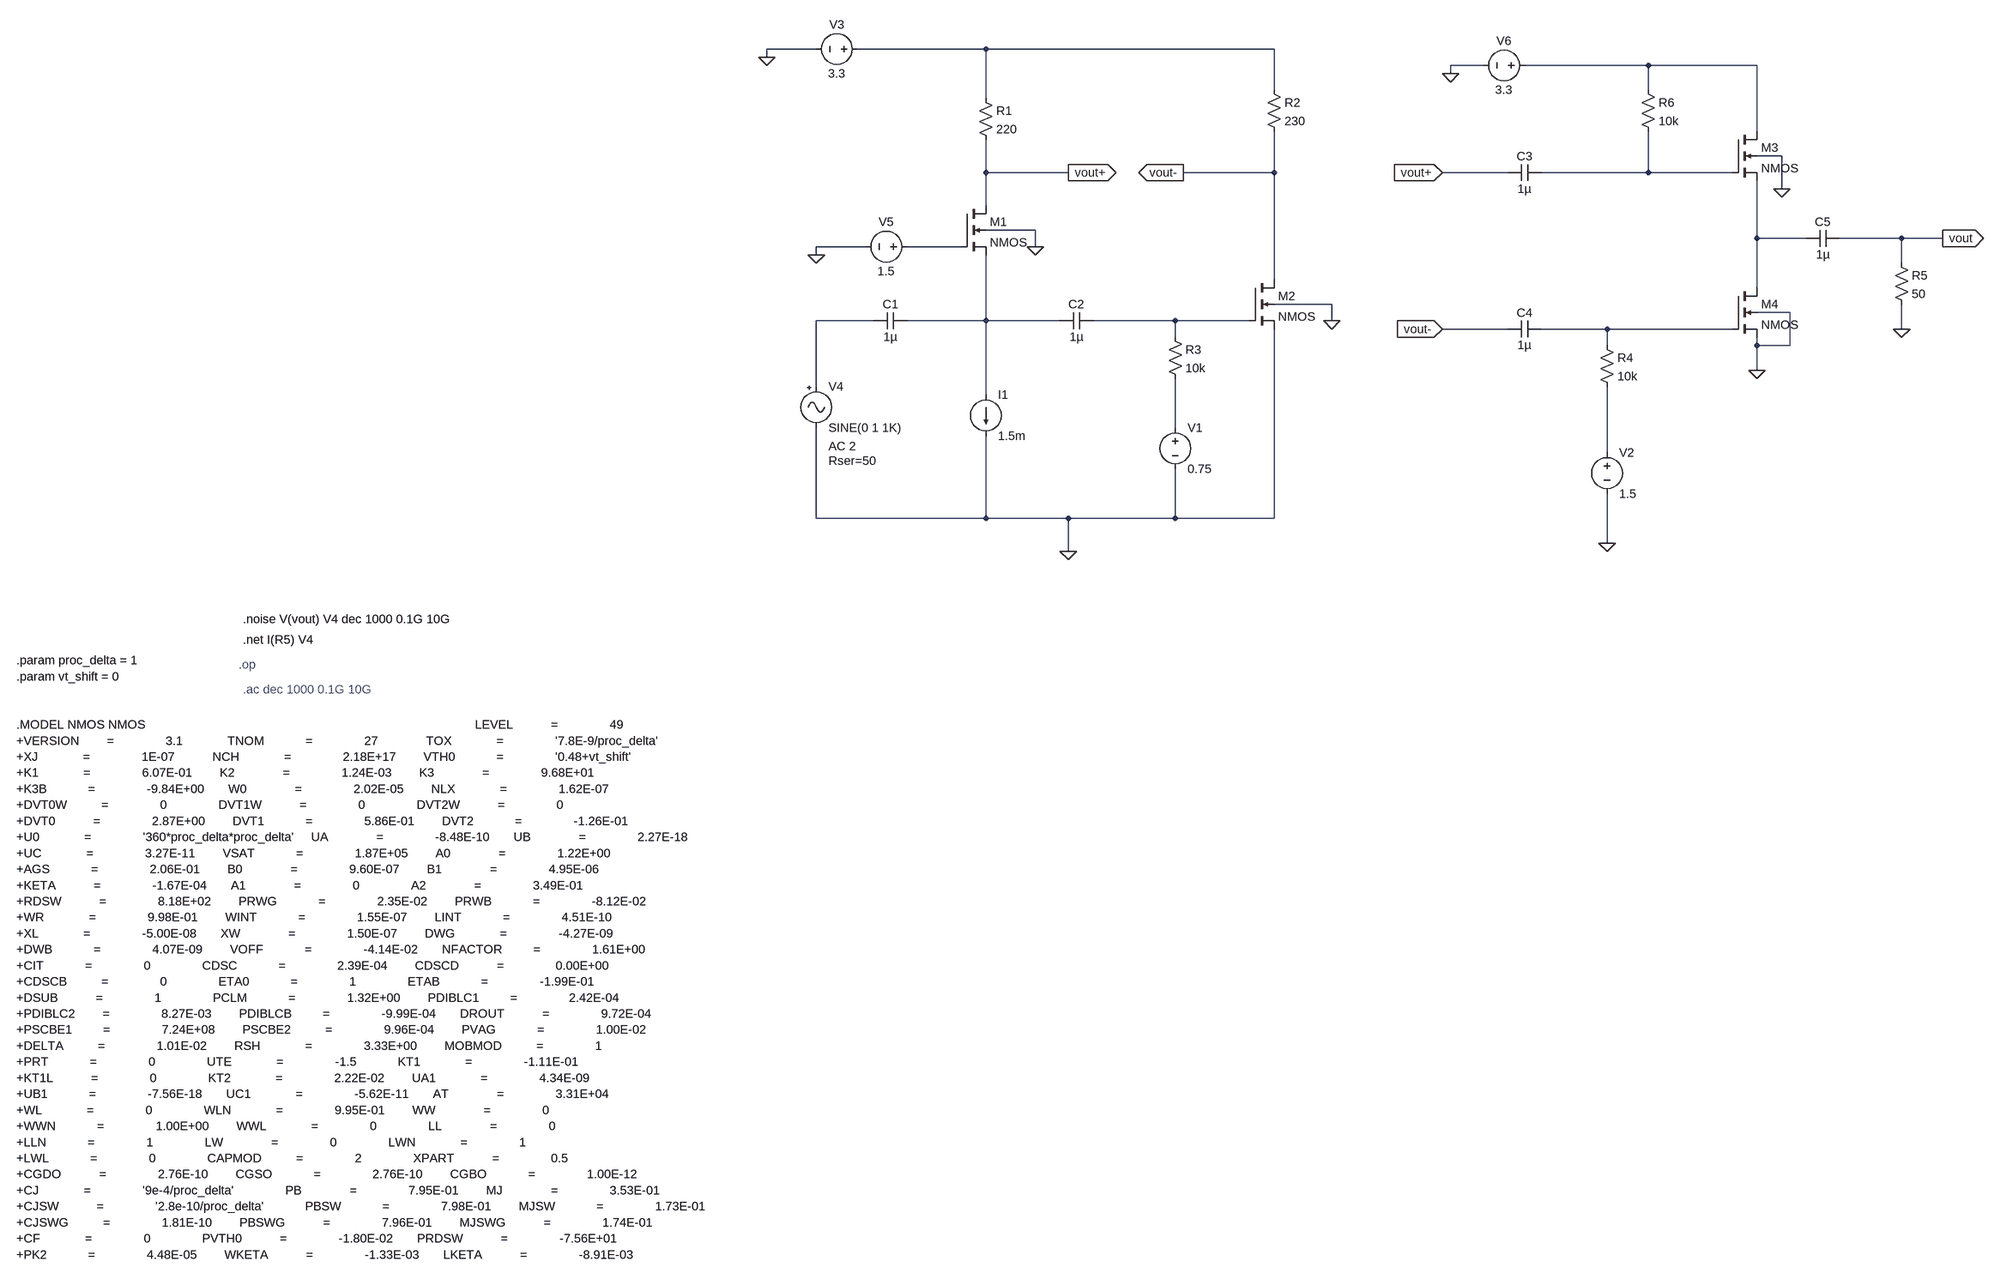
[diagram p0: schematic Circuit_L350nm_n_1.asc]
Circuit_L350nm_n_1.asc, the LTspice schematic file:
Version 4
SHEET 1 2732 3340
WIRE -224 -80 -320 -80
WIRE 112 -80 -144 -80
WIRE 672 -80 112 -80
WIRE -320 -64 -320 -80
WIRE 1312 -48 1248 -48
WIRE 1632 -48 1392 -48
WIRE 2000 -48 1632 -48
WIRE 1248 -32 1248 -48
WIRE 672 0 672 -80
WIRE 1632 0 1632 -48
WIRE 112 16 112 -80
WIRE 2000 80 2000 -48
WIRE 2048 128 2000 128
WIRE 112 160 112 96
WIRE 272 160 112 160
WIRE 672 160 672 80
WIRE 672 160 496 160
WIRE 1360 160 1232 160
WIRE 1632 160 1632 80
WIRE 1632 160 1424 160
WIRE 1952 160 1632 160
WIRE 2048 192 2048 128
WIRE 112 224 112 160
WIRE 208 272 112 272
WIRE 2000 288 2000 176
WIRE 2096 288 2000 288
WIRE 2336 288 2160 288
WIRE 2416 288 2336 288
WIRE -128 304 -224 304
WIRE 64 304 -48 304
WIRE 208 304 208 272
WIRE -224 320 -224 304
WIRE 2336 336 2336 288
WIRE 672 368 672 160
WIRE 2000 384 2000 288
WIRE 784 416 672 416
WIRE 2064 432 2000 432
WIRE -112 448 -224 448
WIRE 112 448 112 320
WIRE 112 448 -48 448
WIRE 256 448 112 448
WIRE 480 448 320 448
WIRE 624 448 480 448
WIRE 784 448 784 416
WIRE 1360 464 1232 464
WIRE 1552 464 1424 464
WIRE 1952 464 1552 464
WIRE 2336 464 2336 416
WIRE 480 480 480 448
WIRE 1552 496 1552 464
WIRE 2000 496 2000 480
WIRE 2064 496 2064 432
WIRE 2064 496 2000 496
WIRE 2000 544 2000 496
WIRE -224 576 -224 448
WIRE 112 592 112 448
WIRE 480 656 480 560
WIRE 1552 704 1552 576
WIRE -224 832 -224 656
WIRE 112 832 112 672
WIRE 112 832 -224 832
WIRE 272 832 112 832
WIRE 480 832 480 736
WIRE 480 832 272 832
WIRE 672 832 672 464
WIRE 672 832 480 832
WIRE 1552 880 1552 784
WIRE 272 896 272 832
FLAG -320 -64 0
FLAG -224 320 0
FLAG 272 896 0
FLAG 208 304 0
FLAG 784 448 0
FLAG 272 160 vout+
IOPIN 272 160 Out
FLAG 496 160 vout-
IOPIN 496 160 Out
FLAG 1552 880 0
FLAG 2000 544 0
FLAG 2336 464 0
FLAG 1232 160 vout+
IOPIN 1232 160 In
FLAG 1232 464 vout-
IOPIN 1232 464 In
FLAG 2048 192 0
FLAG 1248 -32 0
FLAG 2416 288 vout
IOPIN 2416 288 Out
SYMBOL res 96 0 R0
SYMATTR InstName R1
SYMATTR Value 220
SYMBOL res 656 -16 R0
SYMATTR InstName R2
SYMATTR Value 230
SYMBOL cap -48 432 R90
WINDOW 0 0 32 VBottom 2
WINDOW 3 32 32 VTop 2
SYMATTR InstName C1
SYMATTR Value 1µ
SYMBOL voltage 480 640 R0
WINDOW 123 0 0 Left 0
WINDOW 39 0 0 Left 0
SYMATTR InstName V1
SYMATTR Value 0.75
SYMBOL voltage -128 -80 R90
WINDOW 0 -32 56 VBottom 2
WINDOW 3 32 56 VTop 2
WINDOW 123 0 0 Left 0
WINDOW 39 0 0 Left 0
SYMATTR InstName V3
SYMATTR Value 3.3
SYMBOL Misc\\signal -224 560 R0
WINDOW 123 24 132 Left 2
WINDOW 39 24 160 Left 2
SYMATTR Value2 AC 2
SYMATTR SpiceLine Rser=50
SYMATTR InstName V4
SYMBOL current 112 592 R0
WINDOW 123 0 0 Left 0
WINDOW 39 0 0 Left 0
SYMATTR InstName I1
SYMATTR Value 1.5m
SYMBOL voltage -32 304 R90
WINDOW 0 -32 56 VBottom 2
WINDOW 3 32 56 VTop 2
WINDOW 123 0 0 Left 0
WINDOW 39 0 0 Left 0
SYMATTR InstName V5
SYMATTR Value 1.5
SYMBOL nmos4 64 224 R0
SYMATTR InstName M1
SYMATTR Value2 l=350n w=190u
SYMBOL nmos4 624 368 R0
SYMATTR InstName M2
SYMATTR Value2 l=350n w=190u
SYMBOL cap 320 432 R90
WINDOW 0 0 32 VBottom 2
WINDOW 3 32 32 VTop 2
SYMATTR InstName C2
SYMATTR Value 1µ
SYMBOL res 464 464 R0
SYMATTR InstName R3
SYMATTR Value 10k
SYMBOL cap 1424 144 R90
WINDOW 0 0 32 VBottom 2
WINDOW 3 32 32 VTop 2
SYMATTR InstName C3
SYMATTR Value 1µ
SYMBOL cap 1424 448 R90
WINDOW 0 0 32 VBottom 2
WINDOW 3 32 32 VTop 2
SYMATTR InstName C4
SYMATTR Value 1µ
SYMBOL res 1536 480 R0
SYMATTR InstName R4
SYMATTR Value 10k
SYMBOL res 2320 320 R0
SYMATTR InstName R5
SYMATTR Value 50
SYMBOL res 1616 -16 R0
SYMATTR InstName R6
SYMATTR Value 10k
SYMBOL nmos4 1952 80 R0
SYMATTR InstName M3
SYMATTR Value2 l=1050n w=190u
SYMBOL nmos4 1952 384 R0
SYMATTR InstName M4
SYMATTR Value2 l=1050n w=190u
SYMBOL voltage 1552 688 R0
WINDOW 123 0 0 Left 0
WINDOW 39 0 0 Left 0
SYMATTR InstName V2
SYMATTR Value 1.5
SYMBOL cap 2160 272 R90
WINDOW 0 0 32 VBottom 2
WINDOW 3 32 32 VTop 2
SYMATTR InstName C5
SYMATTR Value 1µ
SYMBOL voltage 1408 -48 R90
WINDOW 0 -32 56 VBottom 2
WINDOW 3 32 56 VTop 2
WINDOW 123 0 0 Left 0
WINDOW 39 0 0 Left 0
SYMATTR InstName V6
SYMATTR Value 3.3
TEXT -1504 2296 Left 2 ;.op
TEXT -1936 2288 Left 2 !.param proc_delta = 1\n.param vt_shift = 0\n \n \n.MODEL NMOS NMOS                                                                                                LEVEL           =               49\n+VERSION        =               3.1             TNOM            =               27              TOX             =               '7.8E-9/proc_delta'\n+XJ             =               1E-07           NCH             =               2.18E+17        VTH0            =               '0.48+vt_shift'\n+K1             =               6.07E-01        K2              =               1.24E-03        K3              =               9.68E+01\n+K3B            =               -9.84E+00       W0              =               2.02E-05        NLX             =               1.62E-07\n+DVT0W          =               0               DVT1W           =               0               DVT2W           =               0\n+DVT0           =               2.87E+00        DVT1            =               5.86E-01        DVT2            =               -1.26E-01\n+U0             =               '360*proc_delta*proc_delta'     UA              =               -8.48E-10       UB              =               2.27E-18\n+UC             =               3.27E-11        VSAT            =               1.87E+05        A0              =               1.22E+00\n+AGS            =               2.06E-01        B0              =               9.60E-07        B1              =               4.95E-06\n+KETA           =               -1.67E-04       A1              =               0               A2              =               3.49E-01\n+RDSW           =               8.18E+02        PRWG            =               2.35E-02        PRWB            =               -8.12E-02\n+WR             =               9.98E-01        WINT            =               1.55E-07        LINT            =               4.51E-10\n+XL             =               -5.00E-08       XW              =               1.50E-07        DWG             =               -4.27E-09\n+DWB            =               4.07E-09        VOFF            =               -4.14E-02       NFACTOR         =               1.61E+00\n+CIT            =               0               CDSC            =               2.39E-04        CDSCD           =               0.00E+00\n+CDSCB          =               0               ETA0            =               1               ETAB            =               -1.99E-01\n+DSUB           =               1               PCLM            =               1.32E+00        PDIBLC1         =               2.42E-04\n+PDIBLC2        =               8.27E-03        PDIBLCB         =               -9.99E-04       DROUT           =               9.72E-04\n+PSCBE1         =               7.24E+08        PSCBE2          =               9.96E-04        PVAG            =               1.00E-02\n+DELTA          =               1.01E-02        RSH             =               3.33E+00        MOBMOD          =               1\n+PRT            =               0               UTE             =               -1.5            KT1             =               -1.11E-01\n+KT1L           =               0               KT2             =               2.22E-02        UA1             =               4.34E-09\n+UB1            =               -7.56E-18       UC1             =               -5.62E-11       AT              =               3.31E+04\n+WL             =               0               WLN             =               9.95E-01        WW              =               0\n+WWN            =               1.00E+00        WWL             =               0               LL              =               0\n+LLN            =               1               LW              =               0               LWN             =               1\n+LWL            =               0               CAPMOD          =               2               XPART           =               0.5\n+CGDO           =               2.76E-10        CGSO            =               2.76E-10        CGBO            =               1.00E-12\n+CJ             =               '9e-4/proc_delta'               PB              =               7.95E-01        MJ              =               3.53E-01\n+CJSW           =               '2.8e-10/proc_delta'            PBSW            =               7.98E-01        MJSW            =               1.73E-01\n+CJSWG          =               1.81E-10        PBSWG           =               7.96E-01        MJSWG           =               1.74E-01\n+CF             =               0               PVTH0           =               -1.80E-02       PRDSW           =               -7.56E+01\n+PK2            =               4.48E-05        WKETA           =               -1.33E-03       LKETA           =               -8.91E-03
TEXT -1496 2344 Left 2 ;.ac dec 1000 0.1G 10G
TEXT -1496 2248 Left 2 !.net I(R5) V4
TEXT -1496 2208 Left 2 !.noise V(vout) V4 dec 1000 0.1G 10G

The netlist it stands for:
* Circuit_L350nm_n_1.asc
R1 N001 vout+ 220
R2 N001 vout- 230
C1 N007 N006 1µ
V1 N010 0 0.75
V3 N001 0 3.3
V4 N006 0 SINE(0 1 1K) AC 2 Rser=50
I1 N007 0 1.5m
V5 N005 0 1.5
M1 vout+ N005 N007 0 NMOS l=350n w=190u
M2 vout- N008 0 0 NMOS l=350n w=190u
C2 N008 N007 1µ
R3 N008 N010 10k
C3 N003 vout+ 1µ
C4 N009 vout- 1µ
R4 N009 N011 10k
R5 vout 0 50
R6 N002 N003 10k
M3 N002 N003 N004 0 NMOS l=1050n w=190u
M4 N004 N009 0 0 NMOS l=1050n w=190u
V2 N011 0 1.5
C5 vout N004 1µ
V6 N002 0 3.3
.model NMOS NMOS
.model PMOS PMOS
.lib standard.mos
* .op
.param proc_delta = 1
.param vt_shift = 0
.MODEL NMOS NMOS                                                                                                LEVEL           =               49
+VERSION        =               3.1             TNOM            =               27              TOX             =               '7.8E-9/proc_delta'
+XJ             =               1E-07           NCH             =               2.18E+17        VTH0            =               '0.48+vt_shift'
+K1             =               6.07E-01        K2              =               1.24E-03        K3              =               9.68E+01
+K3B            =               -9.84E+00       W0              =               2.02E-05        NLX             =               1.62E-07
+DVT0W          =               0               DVT1W           =               0               DVT2W           =               0
+DVT0           =               2.87E+00        DVT1            =               5.86E-01        DVT2            =               -1.26E-01
+U0             =               '360*proc_delta*proc_delta'     UA              =               -8.48E-10       UB              =               2.27E-18
+UC             =               3.27E-11        VSAT            =               1.87E+05        A0              =               1.22E+00
+AGS            =               2.06E-01        B0              =               9.60E-07        B1              =               4.95E-06
+KETA           =               -1.67E-04       A1              =               0               A2              =               3.49E-01
+RDSW           =               8.18E+02        PRWG            =               2.35E-02        PRWB            =               -8.12E-02
+WR             =               9.98E-01        WINT            =               1.55E-07        LINT            =               4.51E-10
+XL             =               -5.00E-08       XW              =               1.50E-07        DWG             =               -4.27E-09
+DWB            =               4.07E-09        VOFF            =               -4.14E-02       NFACTOR         =               1.61E+00
+CIT            =               0               CDSC            =               2.39E-04        CDSCD           =               0.00E+00
+CDSCB          =               0               ETA0            =               1               ETAB            =               -1.99E-01
+DSUB           =               1               PCLM            =               1.32E+00        PDIBLC1         =               2.42E-04
+PDIBLC2        =               8.27E-03        PDIBLCB         =               -9.99E-04       DROUT           =               9.72E-04
+PSCBE1         =               7.24E+08        PSCBE2          =               9.96E-04        PVAG            =               1.00E-02
+DELTA          =               1.01E-02        RSH             =               3.33E+00        MOBMOD          =               1
+PRT            =               0               UTE             =               -1.5            KT1             =               -1.11E-01
+KT1L           =               0               KT2             =               2.22E-02        UA1             =               4.34E-09
+UB1            =               -7.56E-18       UC1             =               -5.62E-11       AT              =               3.31E+04
+WL             =               0               WLN             =               9.95E-01        WW              =               0
+WWN            =               1.00E+00        WWL             =               0               LL              =               0
+LLN            =               1               LW              =               0               LWN             =               1
+LWL            =               0               CAPMOD          =               2               XPART           =               0.5
+CGDO           =               2.76E-10        CGSO            =               2.76E-10        CGBO            =               1.00E-12
+CJ             =               '9e-4/proc_delta'               PB              =               7.95E-01        MJ              =               3.53E-01
+CJSW           =               '2.8e-10/proc_delta'            PBSW            =               7.98E-01        MJSW            =               1.73E-01
+CJSWG          =               1.81E-10        PBSWG           =               7.96E-01        MJSWG           =               1.74E-01
+CF             =               0               PVTH0           =               -1.80E-02       PRDSW           =               -7.56E+01
+PK2            =               4.48E-05        WKETA           =               -1.33E-03       LKETA           =               -8.91E-03
* .ac dec 1000 0.1G 10G
.net I(R5) V4
.noise V(vout) V4 dec 1000 0.1G 10G
.backanno
.end